# Altium schematic sheet SCB_MAIN.SchDoc
size A2
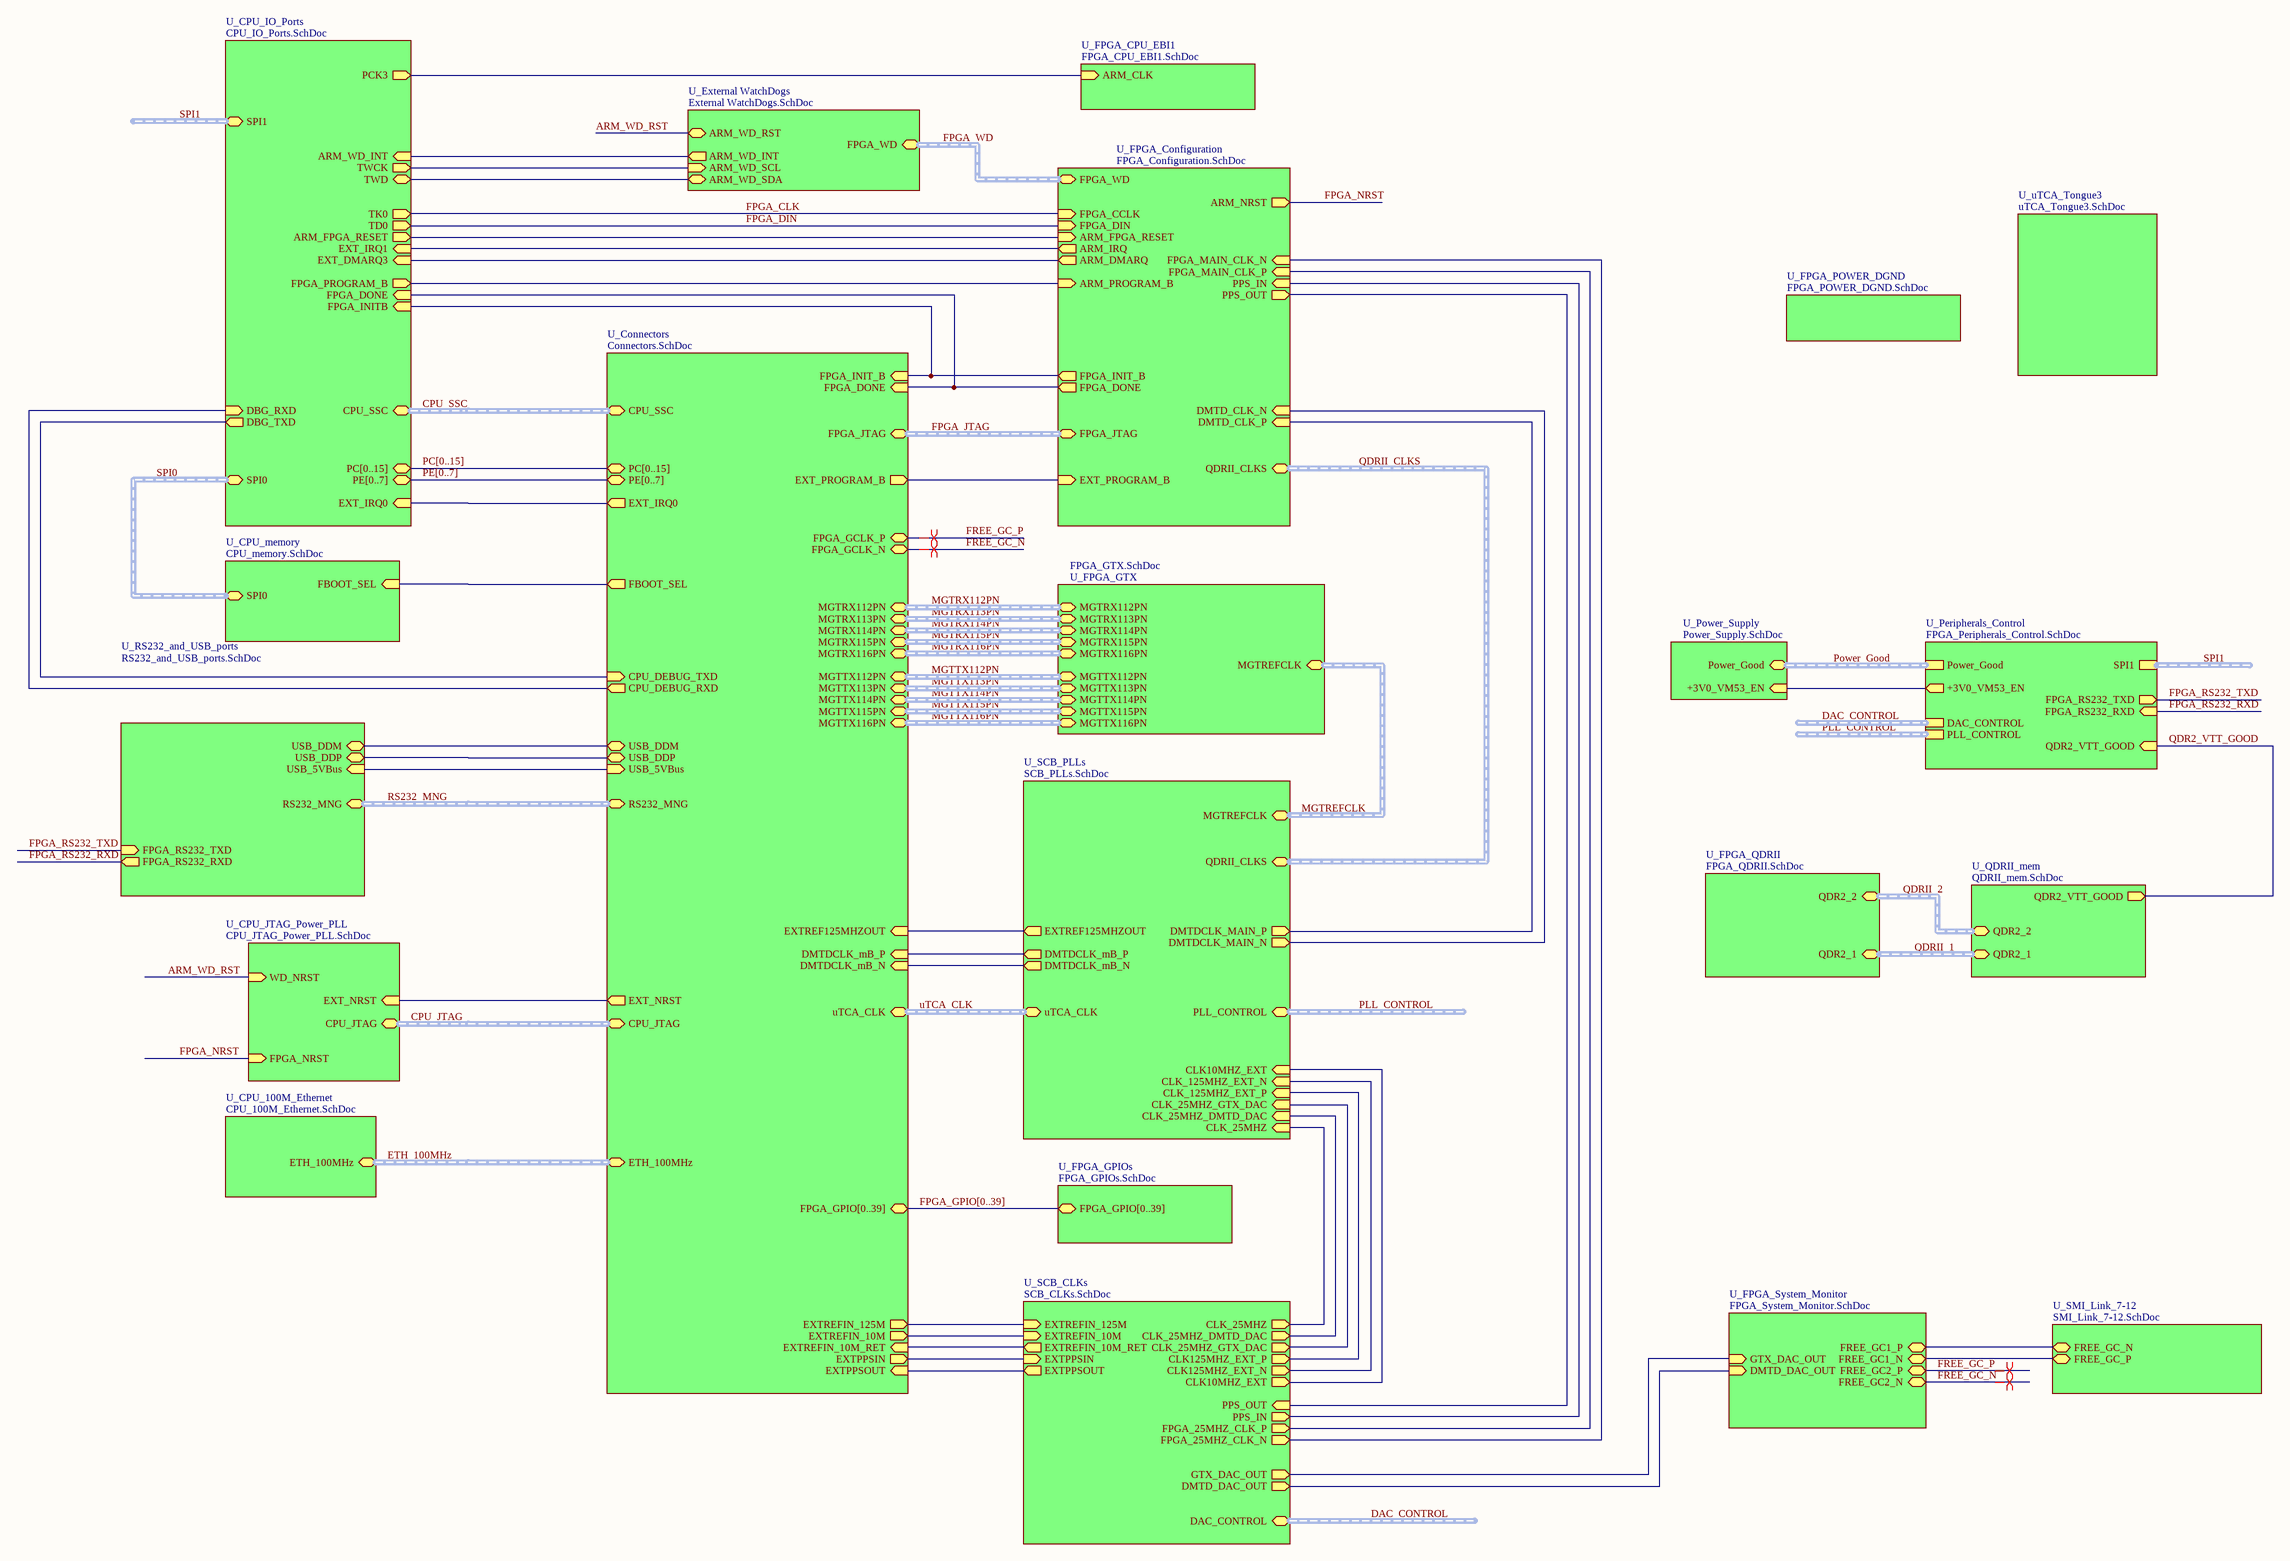
[diagram p0: SCB_MAIN.SchDoc]

## Sub-sheets
U_Connectors = Connectors.SchDoc: USB_DDM (bidir), USB_DDP (bidir), USB_5VBus (in), CPU_DEBUG_TXD (in), CPU_DEBUG_RXD (out), EXTPPSIN (out), EXTREFIN_10M (out), EXTREFIN_125M (out), EXTPPSOUT (in), EXTREF125MHZOUT (in), FBOOT_SEL (out), EXT_IRQ0 (out), EXT_NRST (out), FPGA_GCLK_P (bidir), EXT_PROGRAM_B (out), FPGA_DONE (in), FPGA_INIT_B (in), PC[0..15] (bidir), PE[0..7] (bidir), FPGA_GPIO[0..39] (bidir), DMTDCLK_mB_P (in), DMTDCLK_mB_N (in), FPGA_GCLK_N (bidir), MGTTX112PN (harness MGTTX112PN), MGTTX113PN (harness MGTTX113PN), MGTTX114PN (harness MGTTX114PN), MGTTX115PN (harness MGTTX115PN), MGTTX116PN (harness MGTTX116PN), MGTRX112PN (harness MGTRX112PN), MGTRX113PN (harness MGTRX113PN), MGTRX114PN (harness MGTRX114PN), MGTRX115PN (harness MGTRX115PN), MGTRX116PN (harness MGTRX116PN), ETH_100MHz (harness ETH_100MHz), uTCA_CLK (harness uTCA_CLK), CPU_JTAG (harness CPU_JTAG), FPGA_JTAG (harness FPGA_JTAG), CPU_SSC (harness CPU_SSC), RS232_MNG (harness RS232_MNG), EXTREFIN_10M_RET (in)
U_CPU_100M_Ethernet = CPU_100M_Ethernet.SchDoc: ETH_100MHz (harness ETH_100MHz)
U_CPU_IO_Ports = CPU_IO_Ports.SchDoc: EXT_DMARQ3 (in), DBG_TXD (out), DBG_RXD (in), TK0 (out), TD0 (out), PE[0..7] (bidir), PC[0..15] (bidir), EXT_IRQ1 (in), EXT_IRQ0 (in), PCK3 (out), FPGA_DONE (in), FPGA_INITB (in), TWD (bidir), TWCK (out), ARM_WD_INT (in), FPGA_PROGRAM_B (out), CPU_SSC (harness CPU_SSC), SPI0 (harness SPI0), SPI1 (harness SPI1), ARM_FPGA_RESET (out)
U_CPU_JTAG_Power_PLL = CPU_JTAG_Power_PLL.SchDoc: EXT_NRST (in), WD_NRST (in), FPGA_NRST (in), CPU_JTAG (harness CPU_JTAG)
U_CPU_memory = CPU_memory.SchDoc: FBOOT_SEL (in), SPI0 (harness SPI0)
U_External WatchDogs = External WatchDogs.SchDoc: ARM_WD_SCL (in), ARM_WD_SDA (bidir), ARM_WD_INT (out), ARM_WD_RST (bidir), FPGA_WD (harness FPGA_WD)
U_FPGA_Configuration = FPGA_Configuration.SchDoc: FPGA_DONE (out), FPGA_INIT_B (out), ARM_PROGRAM_B (in), FPGA_CCLK (in), FPGA_DIN (in), EXT_PROGRAM_B (in), ARM_NRST (out), ARM_DMARQ (out), ARM_IRQ (out), DMTD_CLK_P (in), DMTD_CLK_N (in), PPS_IN (in), PPS_OUT (out), FPGA_MAIN_CLK_P (in), FPGA_MAIN_CLK_N (in), QDRII_CLKS (harness QDRII_CLKS), FPGA_JTAG (harness FPGA_JTAG), FPGA_WD (harness FPGA_WD), ARM_FPGA_RESET (in)
U_FPGA_CPU_EBI1 = FPGA_CPU_EBI1.SchDoc: ARM_CLK (in)
U_FPGA_GPIOs = FPGA_GPIOs.SchDoc: FPGA_GPIO[0..39] (bidir)
U_FPGA_GTX = FPGA_GTX.SchDoc: MGTREFCLK (harness MGTREFCLK), MGTRX116PN (harness MGTRX116PN), MGTRX115PN (harness MGTRX115PN), MGTRX114PN (harness MGTRX114PN), MGTRX113PN (harness MGTRX113PN), MGTRX112PN (harness MGTRX112PN), MGTTX112PN (harness MGTTX112PN), MGTTX113PN (harness MGTTX113PN), MGTTX114PN (harness MGTTX114PN), MGTTX115PN (harness MGTTX115PN), MGTTX116PN (harness MGTTX116PN)
U_FPGA_POWER_DGND = FPGA_POWER_DGND.SchDoc: no entries
U_FPGA_QDRII = FPGA_QDRII.SchDoc: QDR2_2 (harness qdr2_2_bus), QDR2_1 (harness qdr2_1_bus)
U_FPGA_System_Monitor = FPGA_System_Monitor.SchDoc: DMTD_DAC_OUT (in), GTX_DAC_OUT (in), FREE_GC1_P (bidir), FREE_GC1_N (bidir), FREE_GC2_P (bidir), FREE_GC2_N (bidir)
U_Peripherals_Control = FPGA_Peripherals_Control.SchDoc: SPI1 (harness SPI1), Power_Good (harness Power-Good), DAC_CONTROL (harness DAC_CONTROL), PLL_CONTROL (harness PLL_CONTROL), QDR2_VTT_GOOD (in), +3V0_VM53_EN (out), FPGA_RS232_TXD (out), FPGA_RS232_RXD (in)
U_Power_Supply = Power_Supply.SchDoc: Power_Good (harness Power-Good), +3V0_VM53_EN (in)
U_QDRII_mem = QDRII_mem.SchDoc: QDR2_VTT_GOOD (out), QDR2_1 (harness qdr2_1_bus), QDR2_2 (harness qdr2_2_bus)
U_RS232_and_USB_ports = RS232_and_USB_ports.SchDoc: USB_DDM (bidir), USB_DDP (bidir), USB_5VBus (in), FPGA_RS232_TXD (in), FPGA_RS232_RXD (out), RS232_MNG (harness RS232_MNG)
U_SCB_CLKs = SCB_CLKs.SchDoc: EXTREFIN_10M (in), CLK10MHZ_EXT (out), CLK_25MHZ_GTX_DAC (out), CLK_25MHZ_DMTD_DAC (out), EXTPPSIN (in), EXTPPSOUT (out), EXTREFIN_125M (in), CLK125MHZ_EXT_P (out), CLK125MHZ_EXT_N (out), CLK_25MHZ (out), FPGA_25MHZ_CLK_P (out), FPGA_25MHZ_CLK_N (out), DMTD_DAC_OUT (out), GTX_DAC_OUT (out), PPS_IN (out), PPS_OUT (in), DAC_CONTROL (harness DAC_CONTROL), EXTREFIN_10M_RET (out)
U_SCB_PLLs = SCB_PLLs.SchDoc: CLK_125MHZ_EXT_P (in), CLK_125MHZ_EXT_N (in), CLK_25MHZ_GTX_DAC (in), CLK10MHZ_EXT (in), DMTDCLK_MAIN_P (out), DMTDCLK_MAIN_N (out), CLK_25MHZ_DMTD_DAC (in), EXTREF125MHZOUT (out), CLK_25MHZ (in), DMTDCLK_mB_P (out), DMTDCLK_mB_N (out), PLL_CONTROL (harness PLL_CONTROL), QDRII_CLKS (harness QDRII_CLKS), MGTREFCLK (harness MGTREFCLK), uTCA_CLK (harness uTCA_CLK)
U_SMI_Link_7-12 = SMI_Link_7-12.SchDoc: FREE_GC_P (bidir), FREE_GC_N (bidir)
U_uTCA_Tongue3 = uTCA_Tongue3.SchDoc: no entries

## Nets
ARM_WD_RST: sheet U_CPU_JTAG_Power_PLL/WD_NRST, sheet U_External WatchDogs/ARM_WD_RST
FPGA_CLK: sheet U_FPGA_Configuration/FPGA_CCLK, sheet U_CPU_IO_Ports/TK0
FPGA_DIN: sheet U_FPGA_Configuration/FPGA_DIN, sheet U_CPU_IO_Ports/TD0
FPGA_NRST: sheet U_CPU_JTAG_Power_PLL/FPGA_NRST, sheet U_FPGA_Configuration/ARM_NRST
FPGA_RS232_RXD: sheet U_RS232_and_USB_ports/FPGA_RS232_RXD, sheet U_Peripherals_Control/FPGA_RS232_RXD
FPGA_RS232_TXD: sheet U_RS232_and_USB_ports/FPGA_RS232_TXD, sheet U_Peripherals_Control/FPGA_RS232_TXD
FREE_GC_N: sheet U_Connectors/FPGA_GCLK_N, sheet U_FPGA_System_Monitor/FREE_GC2_N
FREE_GC_P: sheet U_Connectors/FPGA_GCLK_P, sheet U_FPGA_System_Monitor/FREE_GC2_P
QDR2_VTT_GOOD: sheet U_QDRII_mem/QDR2_VTT_GOOD, sheet U_Peripherals_Control/QDR2_VTT_GOOD
(unnamed): sheet U_Connectors/USB_DDM, sheet U_RS232_and_USB_ports/USB_DDM
(unnamed): sheet U_Connectors/USB_DDP, sheet U_RS232_and_USB_ports/USB_DDP
(unnamed): sheet U_Connectors/USB_5VBus, sheet U_RS232_and_USB_ports/USB_5VBus
(unnamed): sheet U_Connectors/CPU_DEBUG_TXD, sheet U_CPU_IO_Ports/DBG_TXD
(unnamed): sheet U_Connectors/CPU_DEBUG_RXD, sheet U_CPU_IO_Ports/DBG_RXD
(unnamed): sheet U_Connectors/EXTPPSIN, sheet U_SCB_CLKs/EXTPPSIN
(unnamed): sheet U_Connectors/EXTREFIN_10M, sheet U_SCB_CLKs/EXTREFIN_10M
(unnamed): sheet U_Connectors/EXTREFIN_125M, sheet U_SCB_CLKs/EXTREFIN_125M
(unnamed): sheet U_Connectors/EXTPPSOUT, sheet U_SCB_CLKs/EXTPPSOUT
(unnamed): sheet U_Connectors/EXTREF125MHZOUT, sheet U_SCB_PLLs/EXTREF125MHZOUT
(unnamed): sheet U_Connectors/FBOOT_SEL, sheet U_CPU_memory/FBOOT_SEL
(unnamed): sheet U_Connectors/EXT_IRQ0, sheet U_CPU_IO_Ports/EXT_IRQ0
(unnamed): sheet U_Connectors/EXT_NRST, sheet U_CPU_JTAG_Power_PLL/EXT_NRST
(unnamed): sheet U_Connectors/EXT_PROGRAM_B, sheet U_FPGA_Configuration/EXT_PROGRAM_B
(unnamed): sheet U_Connectors/FPGA_DONE, sheet U_FPGA_Configuration/FPGA_DONE, sheet U_CPU_IO_Ports/FPGA_DONE
(unnamed): sheet U_Connectors/FPGA_INIT_B, sheet U_FPGA_Configuration/FPGA_INIT_B, sheet U_CPU_IO_Ports/FPGA_INITB
(unnamed): sheet U_Connectors/DMTDCLK_mB_P, sheet U_SCB_PLLs/DMTDCLK_mB_P
(unnamed): sheet U_Connectors/DMTDCLK_mB_N, sheet U_SCB_PLLs/DMTDCLK_mB_N
(unnamed): sheet U_Connectors/EXTREFIN_10M_RET, sheet U_SCB_CLKs/EXTREFIN_10M_RET
(unnamed): sheet U_SCB_CLKs/CLK10MHZ_EXT, sheet U_SCB_PLLs/CLK10MHZ_EXT
(unnamed): sheet U_SCB_CLKs/CLK_25MHZ_GTX_DAC, sheet U_SCB_PLLs/CLK_25MHZ_GTX_DAC
(unnamed): sheet U_SCB_CLKs/CLK_25MHZ_DMTD_DAC, sheet U_SCB_PLLs/CLK_25MHZ_DMTD_DAC
(unnamed): sheet U_SCB_CLKs/CLK125MHZ_EXT_P, sheet U_SCB_PLLs/CLK_125MHZ_EXT_P
(unnamed): sheet U_SCB_CLKs/CLK125MHZ_EXT_N, sheet U_SCB_PLLs/CLK_125MHZ_EXT_N
(unnamed): sheet U_SCB_CLKs/CLK_25MHZ, sheet U_SCB_PLLs/CLK_25MHZ
(unnamed): sheet U_SCB_CLKs/FPGA_25MHZ_CLK_P, sheet U_FPGA_Configuration/FPGA_MAIN_CLK_P
(unnamed): sheet U_SCB_CLKs/FPGA_25MHZ_CLK_N, sheet U_FPGA_Configuration/FPGA_MAIN_CLK_N
(unnamed): sheet U_SCB_CLKs/DMTD_DAC_OUT, sheet U_FPGA_System_Monitor/DMTD_DAC_OUT
(unnamed): sheet U_SCB_CLKs/GTX_DAC_OUT, sheet U_FPGA_System_Monitor/GTX_DAC_OUT
(unnamed): sheet U_SCB_CLKs/PPS_IN, sheet U_FPGA_Configuration/PPS_IN
(unnamed): sheet U_SCB_CLKs/PPS_OUT, sheet U_FPGA_Configuration/PPS_OUT
(unnamed): sheet U_FPGA_CPU_EBI1/ARM_CLK, sheet U_CPU_IO_Ports/PCK3
(unnamed): sheet U_SMI_Link_7-12/FREE_GC_P, sheet U_FPGA_System_Monitor/FREE_GC1_N
(unnamed): sheet U_SMI_Link_7-12/FREE_GC_N, sheet U_FPGA_System_Monitor/FREE_GC1_P
(unnamed): sheet U_External WatchDogs/ARM_WD_SCL, sheet U_CPU_IO_Ports/TWCK
(unnamed): sheet U_External WatchDogs/ARM_WD_SDA, sheet U_CPU_IO_Ports/TWD
(unnamed): sheet U_External WatchDogs/ARM_WD_INT, sheet U_CPU_IO_Ports/ARM_WD_INT
(unnamed): sheet U_FPGA_Configuration/ARM_PROGRAM_B, sheet U_CPU_IO_Ports/FPGA_PROGRAM_B
(unnamed): sheet U_FPGA_Configuration/ARM_DMARQ, sheet U_CPU_IO_Ports/EXT_DMARQ3
(unnamed): sheet U_FPGA_Configuration/ARM_IRQ, sheet U_CPU_IO_Ports/EXT_IRQ1
(unnamed): sheet U_FPGA_Configuration/DMTD_CLK_P, sheet U_SCB_PLLs/DMTDCLK_MAIN_P
(unnamed): sheet U_FPGA_Configuration/DMTD_CLK_N, sheet U_SCB_PLLs/DMTDCLK_MAIN_N
(unnamed): sheet U_FPGA_Configuration/ARM_FPGA_RESET, sheet U_CPU_IO_Ports/ARM_FPGA_RESET
(unnamed): sheet U_Power_Supply/+3V0_VM53_EN, sheet U_Peripherals_Control/+3V0_VM53_EN

## Buses and harness runs
bus FPGA_GPIO[0..39] = sheet U_Connectors/FPGA_GPIO[0..39] = sheet U_FPGA_GPIOs/FPGA_GPIO[0..39]
bus PC[0..15] = sheet U_Connectors/PC[0..15] = sheet U_CPU_IO_Ports/PC[0..15]
bus PE[0..7] = sheet U_Connectors/PE[0..7] = sheet U_CPU_IO_Ports/PE[0..7]
harness CPU_JTAG = sheet U_Connectors/CPU_JTAG = sheet U_CPU_JTAG_Power_PLL/CPU_JTAG
harness CPU_SSC = sheet U_Connectors/CPU_SSC = sheet U_CPU_IO_Ports/CPU_SSC
harness DAC_CONTROL = sheet U_Peripherals_Control/DAC_CONTROL
harness DAC_CONTROL = sheet U_SCB_CLKs/DAC_CONTROL
harness ETH_100MHz = sheet U_Connectors/ETH_100MHz = sheet U_CPU_100M_Ethernet/ETH_100MHz
harness FPGA_JTAG = sheet U_Connectors/FPGA_JTAG = sheet U_FPGA_Configuration/FPGA_JTAG
harness FPGA_WD = sheet U_External WatchDogs/FPGA_WD = sheet U_FPGA_Configuration/FPGA_WD
harness MGTREFCLK = sheet U_FPGA_GTX/MGTREFCLK = sheet U_SCB_PLLs/MGTREFCLK
harness MGTRX112PN = sheet U_Connectors/MGTRX112PN = sheet U_FPGA_GTX/MGTRX112PN
harness MGTRX113PN = sheet U_Connectors/MGTRX113PN = sheet U_FPGA_GTX/MGTRX113PN
harness MGTRX114PN = sheet U_Connectors/MGTRX114PN = sheet U_FPGA_GTX/MGTRX114PN
harness MGTRX115PN = sheet U_Connectors/MGTRX115PN = sheet U_FPGA_GTX/MGTRX115PN
harness MGTRX116PN = sheet U_Connectors/MGTRX116PN = sheet U_FPGA_GTX/MGTRX116PN
harness MGTTX112PN = sheet U_Connectors/MGTTX112PN = sheet U_FPGA_GTX/MGTTX112PN
harness MGTTX113PN = sheet U_Connectors/MGTTX113PN = sheet U_FPGA_GTX/MGTTX113PN
harness MGTTX114PN = sheet U_Connectors/MGTTX114PN = sheet U_FPGA_GTX/MGTTX114PN
harness MGTTX115PN = sheet U_Connectors/MGTTX115PN = sheet U_FPGA_GTX/MGTTX115PN
harness MGTTX116PN = sheet U_Connectors/MGTTX116PN = sheet U_FPGA_GTX/MGTTX116PN
harness PLL_CONTROL = sheet U_Peripherals_Control/PLL_CONTROL
harness PLL_CONTROL = sheet U_SCB_PLLs/PLL_CONTROL
harness Power_Good = sheet U_Peripherals_Control/Power_Good = sheet U_Power_Supply/Power_Good
harness QDRII_1 = sheet U_FPGA_QDRII/QDR2_1 = sheet U_QDRII_mem/QDR2_1
harness QDRII_2 = sheet U_FPGA_QDRII/QDR2_2 = sheet U_QDRII_mem/QDR2_2
harness QDRII_CLKS = sheet U_FPGA_Configuration/QDRII_CLKS = sheet U_SCB_PLLs/QDRII_CLKS
harness RS232_MNG = sheet U_Connectors/RS232_MNG = sheet U_RS232_and_USB_ports/RS232_MNG
harness SPI0 = sheet U_CPU_IO_Ports/SPI0 = sheet U_CPU_memory/SPI0
harness SPI1 = sheet U_CPU_IO_Ports/SPI1
harness SPI1 = sheet U_Peripherals_Control/SPI1
harness uTCA_CLK = sheet U_Connectors/uTCA_CLK = sheet U_SCB_PLLs/uTCA_CLK

## Layout directives
differential pair: FREE_GC_N, FREE_GC_P